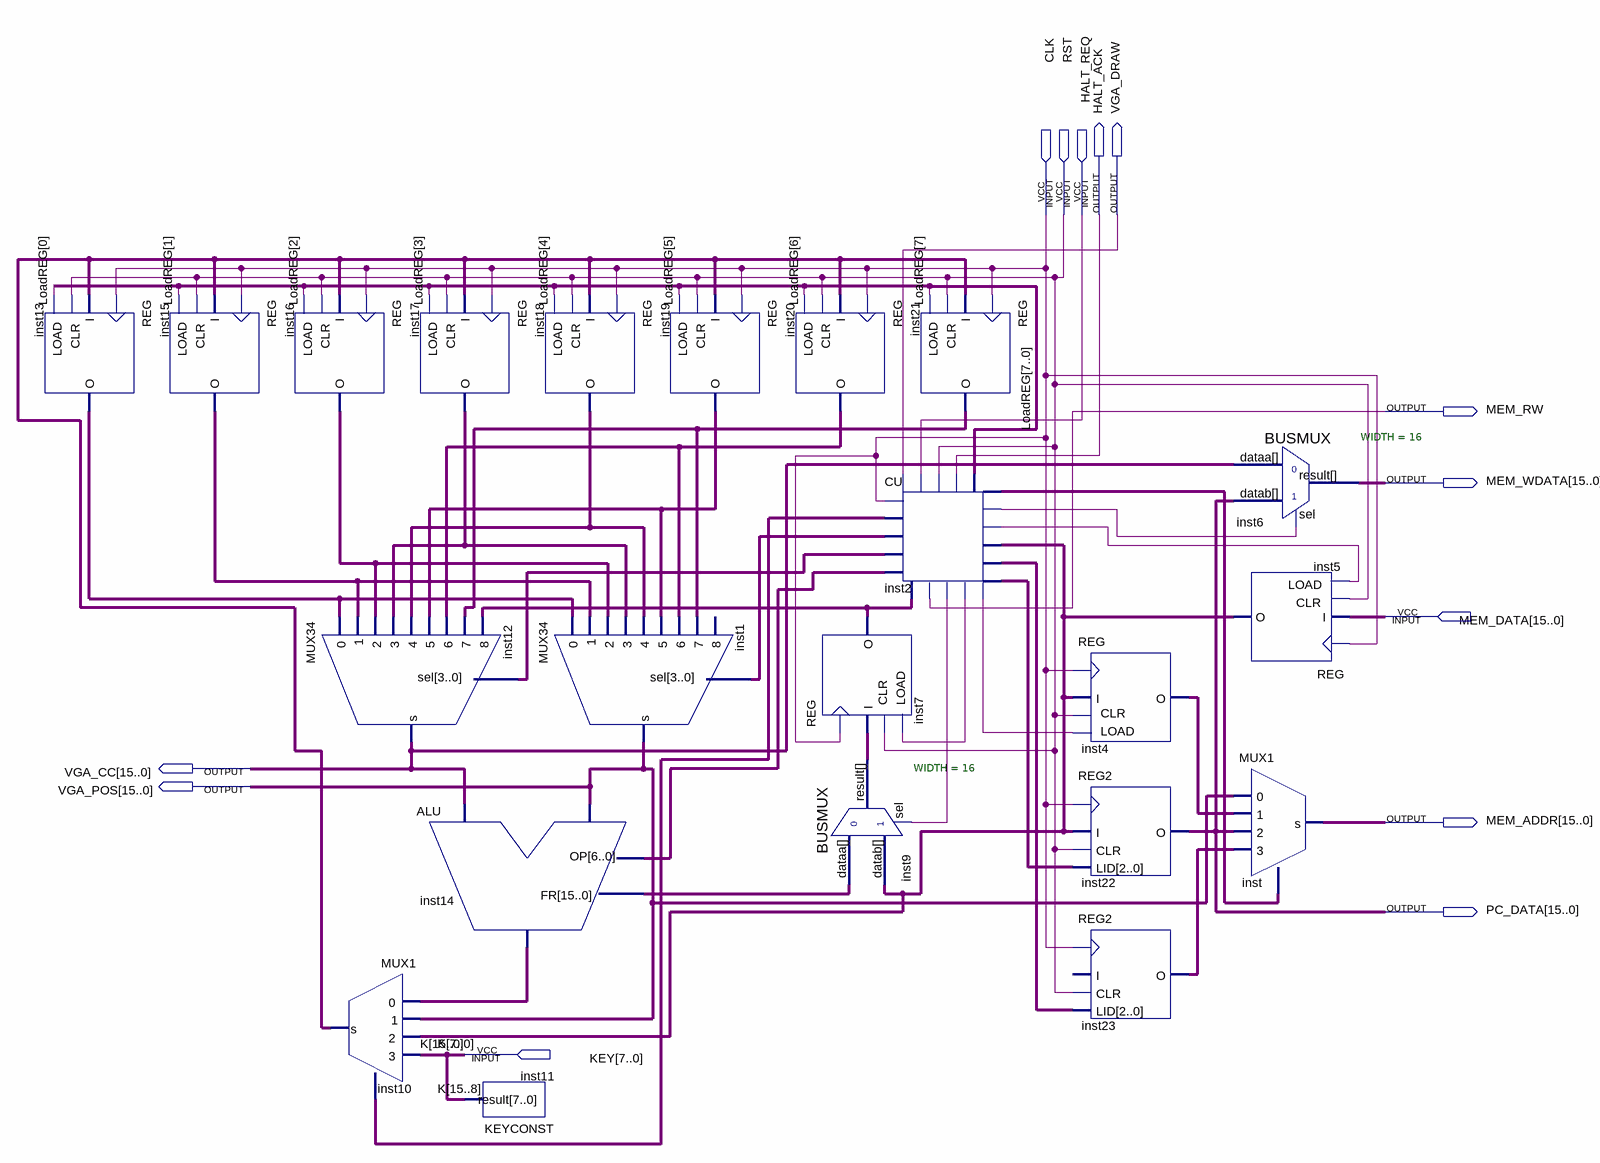
[diagram p0: schematic sheet]
// Quartus schematic AP9_cpu.old.bdf as structural Verilog: 22 symbols, 13 pins
module \AP9_cpu.old  (
  input  CLK,
  input  RST,
  input  HALT_REQ,
  input  [15:0] MEM_DATA,
  input  [7:0] KEY,
  output HALT_ACK,
  output VGA_DRAW,
  output MEM_RW,
  output [15:0] MEM_WDATA,
  output [15:0] VGA_CC,
  output [15:0] VGA_POS,
  output [15:0] MEM_ADDR,
  output [15:0] PC_DATA
);

  wire inst2_loadfr, inst2_loadmar, inst2_loadmbr, inst2_sm5, inst2_sm6;
  wire [1:0] inst2_sm1, inst2_sm2;
  wire [2:0] inst2_lidpc, inst2_lidsp;
  wire [3:0] inst2_sm3, inst2_sm4;
  wire [6:0] inst2_ulaop;
  wire [7:0] LoadREG;
  wire [15:0] inst4_o, inst5_o, inst7_o, inst9_result, inst10_result, inst13_o, inst14_fr, inst14_res,
       inst15_o, inst16_o, inst17_o, inst18_o, inst19_o, inst20_o, inst21_o, inst23_o;
  wire [15:8] K;

  REG inst13 (.CLR(RST), .LOAD(LoadREG[0]), .CLK(CLK), .I(inst10_result), .O(inst13_o));
  REG inst15 (.CLR(RST), .LOAD(LoadREG[1]), .CLK(CLK), .I(inst10_result), .O(inst15_o));
  REG inst16 (.CLR(RST), .LOAD(LoadREG[2]), .CLK(CLK), .I(inst10_result), .O(inst16_o));
  MUX34 inst12 (
    .sel(inst2_sm3), .data0x(inst13_o), .data1x(inst15_o), .data2x(inst16_o), .data3x(inst17_o),
    .data4x(inst18_o), .data5x(inst19_o), .data6x(inst20_o), .data7x(inst21_o), .data8x(inst7_o),
    .result(VGA_CC));
  MUX1 inst10 (
    .data0x(inst14_res), .data1x(VGA_POS), .data2x(inst5_o), .data3x({K, KEY}), .sel(inst2_sm2),
    .result(inst10_result));
  REG inst17 (.CLR(RST), .LOAD(LoadREG[3]), .CLK(CLK), .I(inst10_result), .O(inst17_o));
  ALU inst14 (.OP(inst2_ulaop), .Y(VGA_POS), .X(VGA_CC), .FR(inst14_fr), .RES(inst14_res));
  KEYCONST inst11 (.result(K));
  REG inst18 (.CLR(RST), .LOAD(LoadREG[4]), .CLK(CLK), .I(inst10_result), .O(inst18_o));
  MUX34 inst1 (
    .sel(inst2_sm4), .data0x(inst13_o), .data1x(inst15_o), .data2x(inst16_o), .data3x(inst17_o),
    .data4x(inst18_o), .data5x(inst19_o), .data6x(inst20_o), .data7x(inst21_o), .result(VGA_POS));  // open: data8x
  REG inst19 (.CLR(RST), .LOAD(LoadREG[5]), .CLK(CLK), .I(inst10_result), .O(inst19_o));
  REG inst20 (.CLR(RST), .LOAD(LoadREG[6]), .CLK(CLK), .I(inst10_result), .O(inst20_o));
  REG inst7 (.CLR(RST), .LOAD(inst2_loadfr), .CLK(CLK), .I(inst9_result), .O(inst7_o));
  BUSMUX #(.WIDTH(16)) inst9 (.datab(inst5_o), .sel(inst2_sm6), .dataa(inst14_fr), .result(inst9_result));
  REG inst21 (.CLR(RST), .LOAD(LoadREG[7]), .CLK(CLK), .I(inst10_result), .O(inst21_o));
  CU inst2 (
    .HALT_REQ(HALT_REQ), .CLK(CLK), .RST(RST), .FRIN(inst7_o), .INMEM(inst5_o), .DRAW(VGA_DRAW),
    .HALT_ACK(HALT_ACK), .ULAOP(inst2_ulaop), .sM3(inst2_sm3), .sM4(inst2_sm4), .sM2(inst2_sm2),
    .sM6(inst2_sm6), .RW(MEM_RW), .LoadFR(inst2_loadfr), .LoadMAR(inst2_loadmar), .sM1(inst2_sm1),
    .sM5(inst2_sm5), .LoadMBR(inst2_loadmbr), .LIDSP(inst2_lidsp), .LIDPC(inst2_lidpc), .LoadREG(LoadREG));
  REG inst4 (.CLR(RST), .LOAD(inst2_loadmar), .CLK(CLK), .I(inst5_o), .O(inst4_o));
  REG2 inst22 (.CLR(RST), .LID(inst2_lidpc), .I(inst5_o), .CLK(CLK), .O(PC_DATA));
  REG2 inst23 (.CLR(RST), .LID(inst2_lidsp), .CLK(CLK), .O(inst23_o));  // open: I
  BUSMUX #(.WIDTH(16)) inst6 (.datab(PC_DATA), .sel(inst2_sm5), .dataa(VGA_CC), .result(MEM_WDATA));
  REG inst5 (.CLR(RST), .LOAD(inst2_loadmbr), .CLK(CLK), .I(MEM_DATA), .O(inst5_o));
  MUX1 inst (
    .data0x(VGA_POS), .data1x(inst4_o), .data2x(PC_DATA), .data3x(inst23_o), .sel(inst2_sm1),
    .result(MEM_ADDR));

  // Other names for the same wires on the sheet: K[7:0] = KEY
endmodule
